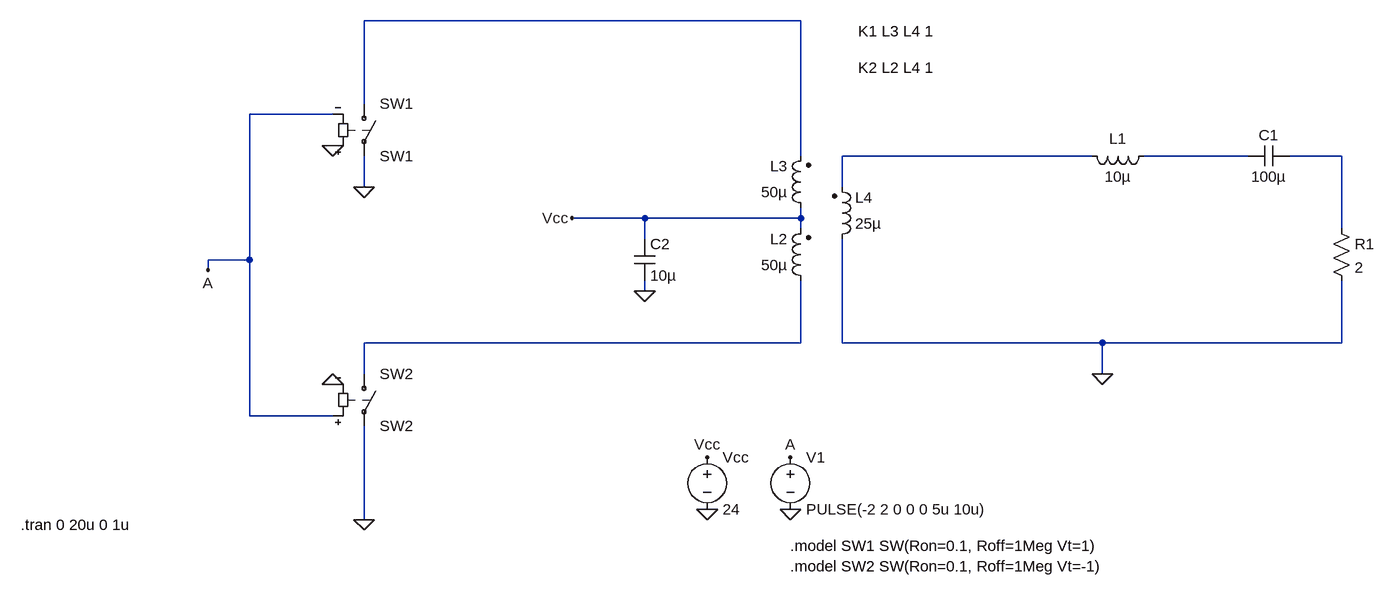
[diagram p0: schematic ClaseD Acoplado por transformador.asc]
ClaseD Acoplado por transformador.asc, the LTspice schematic file:
Version 4
SHEET 1 880 680
WIRE -160 -656 -832 -656
WIRE -832 -528 -832 -656
WIRE -880 -512 -1008 -512
WIRE -160 -448 -160 -656
WIRE 288 -448 -96 -448
WIRE 528 -448 368 -448
WIRE 672 -448 592 -448
WIRE -832 -400 -832 -448
WIRE -96 -400 -96 -448
WIRE -400 -352 -512 -352
WIRE -160 -352 -160 -368
WIRE -160 -352 -400 -352
WIRE -160 -336 -160 -352
WIRE 672 -336 672 -448
WIRE -400 -320 -400 -352
WIRE -1008 -288 -1008 -512
WIRE -1008 -288 -1072 -288
WIRE -1072 -272 -1072 -288
WIRE -400 -240 -400 -256
WIRE -160 -160 -160 -256
WIRE -160 -160 -832 -160
WIRE -96 -160 -96 -320
WIRE 304 -160 -96 -160
WIRE 672 -160 672 -256
WIRE 672 -160 304 -160
WIRE -832 -112 -832 -160
WIRE 304 -112 304 -160
WIRE -1008 -48 -1008 -288
WIRE -880 -48 -1008 -48
WIRE -832 112 -832 -32
FLAG -176 96 0
FLAG -176 16 A
FLAG -880 -464 0
FLAG -880 -96 0
FLAG -1072 -272 A
FLAG -832 112 0
FLAG -832 -400 0
FLAG 304 -112 0
FLAG -512 -352 Vcc
FLAG -400 -240 0
FLAG -304 16 Vcc
FLAG -304 96 0
DATAFLAG -96 -448 ""
DATAFLAG -96 -448 ""
SYMBOL res 656 -352 R0
SYMATTR InstName R1
SYMATTR Value 2
SYMBOL cap 592 -464 R90
WINDOW 0 0 32 VBottom 2
WINDOW 3 32 32 VTop 2
SYMATTR InstName C1
SYMATTR Value 100µ
SYMBOL ind 384 -464 R90
WINDOW 0 5 56 VBottom 2
WINDOW 3 32 56 VTop 2
SYMATTR InstName L1
SYMATTR Value 10µ
SYMATTR SpiceLine Rser=0.1
SYMBOL sw -832 -128 R0
SYMATTR InstName SW2
SYMATTR Value SW2
SYMBOL sw -832 -544 R0
SYMATTR InstName SW1
SYMATTR Value SW1
SYMBOL voltage -176 0 R0
WINDOW 123 0 0 Left 0
WINDOW 39 0 0 Left 0
SYMATTR InstName V1
SYMATTR Value PULSE(-2 2 0 0 0 5u 10u)
SYMBOL ind2 -144 -240 R180
WINDOW 0 36 80 Left 2
WINDOW 3 36 40 Left 2
SYMATTR InstName L2
SYMATTR Value 50µ
SYMATTR Type ind
SYMBOL ind2 -144 -352 R180
WINDOW 0 36 80 Left 2
WINDOW 3 36 40 Left 2
SYMATTR InstName L3
SYMATTR Value 50µ
SYMATTR Type ind
SYMBOL ind2 -112 -304 M180
WINDOW 0 36 80 Left 2
WINDOW 3 36 40 Left 2
SYMATTR InstName L4
SYMATTR Value 25µ
SYMATTR Type ind
SYMBOL cap -416 -320 R0
SYMATTR InstName C2
SYMATTR Value 10µ
SYMBOL voltage -304 0 R0
WINDOW 123 0 0 Left 0
WINDOW 39 0 0 Left 0
SYMATTR InstName Vcc
SYMATTR Value 24
TEXT -176 152 Left 2 !.model SW1 SW(Ron=0.1, Roff=1Meg Vt=1)
TEXT -1360 120 Left 2 !.tran 0 20u 0 1u
TEXT -176 184 Left 2 !.model SW2 SW(Ron=0.1, Roff=1Meg Vt=-1)
TEXT -72 -640 Left 2 !K1 L3 L4 1
TEXT -72 -584 Left 2 !K2 L2 L4 1

The netlist it stands for:
* ClaseD Acoplado por transformador.asc
R1 N004 0 2
C1 N004 N003 100µ
L1 N003 N002 10µ Rser=0.1
SW2 N005 0 A 0 SW2
SW1 N001 0 0 A SW1
V1 A 0 PULSE(-2 2 0 0 0 5u 10u)
L2 N005 Vcc 50µ
L3 Vcc N001 50µ
L4 0 N002 25µ
C2 Vcc 0 10µ
Vcc Vcc 0 24
.model SW1 SW(Ron=0.1, Roff=1Meg Vt=1)
.tran 0 20u 0 1u
.model SW2 SW(Ron=0.1, Roff=1Meg Vt=-1)
K1 L3 L4 1
K2 L2 L4 1
.backanno
.end